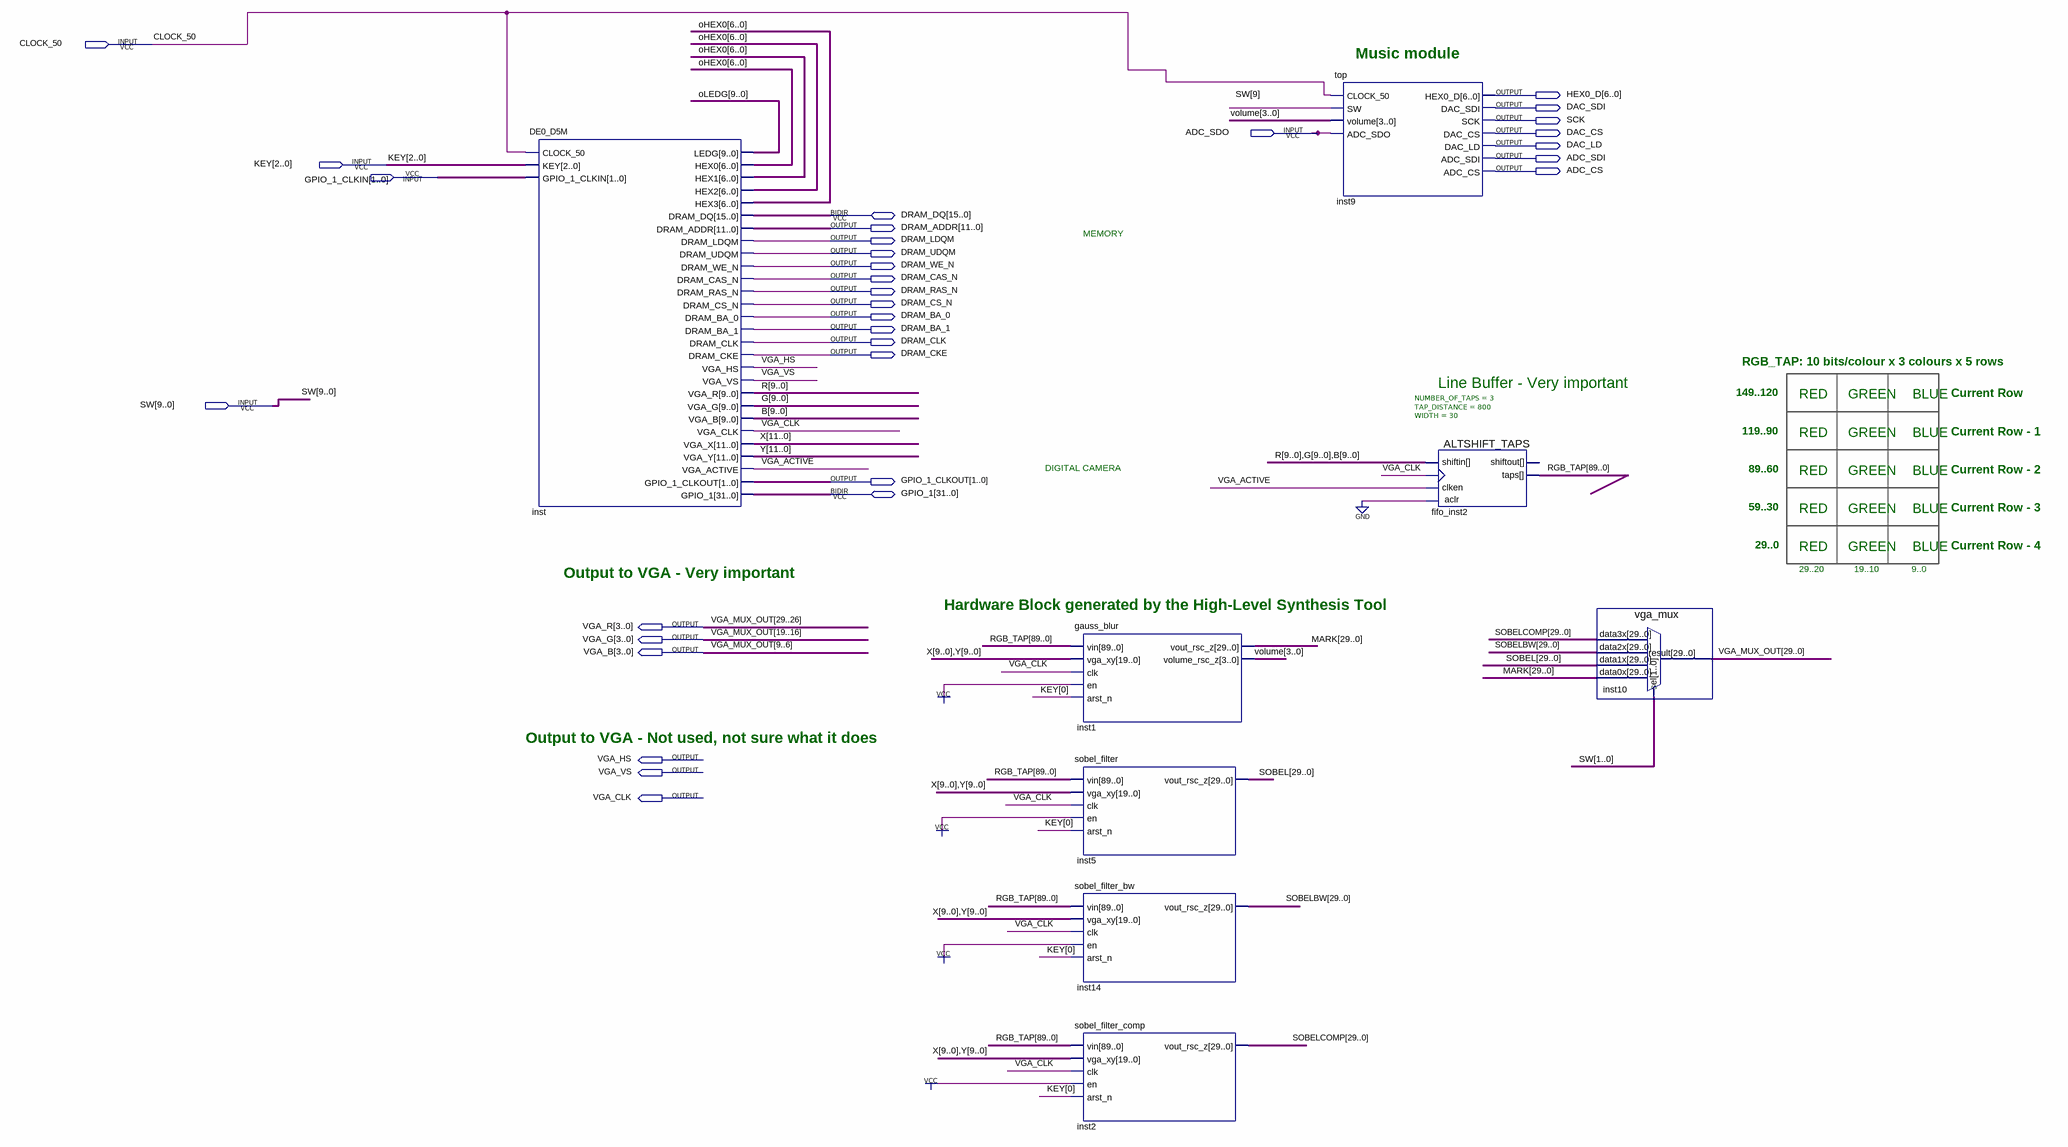
[diagram p0: schematic sheet]
// Quartus schematic TOP_DE0_CAMERA_MOUSE.bdf as structural Verilog: 8 symbols, 32 pins
module TOP_DE0_CAMERA_MOUSE (
  input  CLOCK_50,
  input  ADC_SDO,
  input  [2:0] KEY,
  input  [1:0] GPIO_1_CLKIN,
  input  [9:0] SW,
  inout  [15:0] DRAM_DQ,
  inout  [31:0] GPIO_1,
  output [6:0] HEX0_D,
  output DAC_SDI,
  output SCK,
  output DAC_CS,
  output DAC_LD,
  output ADC_SDI,
  output ADC_CS,
  output [11:0] DRAM_ADDR,
  output DRAM_LDQM,
  output DRAM_UDQM,
  output DRAM_WE_N,
  output DRAM_CAS_N,
  output DRAM_RAS_N,
  output DRAM_CS_N,
  output DRAM_BA_0,
  output DRAM_BA_1,
  output DRAM_CLK,
  output DRAM_CKE,
  output [1:0] GPIO_1_CLKOUT,
  output [3:0] VGA_R,
  output [3:0] VGA_G,
  output [3:0] VGA_B,
  output VGA_HS,
  output VGA_VS,
  output VGA_CLK
);

  wire VGA_ACTIVE;
  wire [3:0] volume;
  wire [6:0] oHEX0;
  wire [9:0] B, G, oLEDG, R;
  wire [11:0] X, Y;
  wire [25:0] VGA_MUX_OUT;
  wire [29:0] MARK, SOBEL, SOBELBW, SOBELCOMP;
  wire [89:0] RGB_TAP;

  DE0_D5M inst (
    .CLOCK_50(CLOCK_50), .KEY(KEY), .GPIO_1_CLKIN(GPIO_1_CLKIN), .LEDG(oLEDG), .HEX0(oHEX0), .HEX1(oHEX0),
    .HEX2(oHEX0), .HEX3(oHEX0), .DRAM_ADDR(DRAM_ADDR), .DRAM_LDQM(DRAM_LDQM), .DRAM_UDQM(DRAM_UDQM),
    .DRAM_WE_N(DRAM_WE_N), .DRAM_CAS_N(DRAM_CAS_N), .DRAM_RAS_N(DRAM_RAS_N), .DRAM_CS_N(DRAM_CS_N),
    .DRAM_BA_0(DRAM_BA_0), .DRAM_BA_1(DRAM_BA_1), .DRAM_CLK(DRAM_CLK), .DRAM_CKE(DRAM_CKE), .VGA_HS(VGA_HS),
    .VGA_VS(VGA_VS), .VGA_R(R), .VGA_G(G), .VGA_B(B), .VGA_CLK(VGA_CLK), .VGA_X(X), .VGA_Y(Y),
    .VGA_ACTIVE(VGA_ACTIVE), .GPIO_1_CLKOUT(GPIO_1_CLKOUT), .DRAM_DQ(DRAM_DQ), .GPIO_1(GPIO_1));
  gauss_blur inst1 (
    .vin(RGB_TAP), .vga_xy({X[9:0], Y[9:0]}), .clk(VGA_CLK), .en(1'b1), .arst_n(KEY[0]), .vout_rsc_z(MARK),
    .volume_rsc_z(volume));
  sobel_filter inst5 (
    .vin(RGB_TAP), .vga_xy({X[9:0], Y[9:0]}), .clk(VGA_CLK), .en(1'b1), .arst_n(KEY[0]), .vout_rsc_z(SOBEL));
  sobel_filter_bw inst14 (
    .vin(RGB_TAP), .vga_xy({X[9:0], Y[9:0]}), .clk(VGA_CLK), .en(1'b1), .arst_n(KEY[0]), .vout_rsc_z(SOBELBW));
  sobel_filter_comp inst2 (
    .vin(RGB_TAP), .vga_xy({X[9:0], Y[9:0]}), .clk(VGA_CLK), .en(1'b1), .arst_n(KEY[0]),
    .vout_rsc_z(SOBELCOMP));
  top inst9 (
    .CLOCK_50(CLOCK_50), .SW(SW[9]), .volume(volume), .ADC_SDO(ADC_SDO), .HEX0_D(HEX0_D), .DAC_SDI(DAC_SDI),
    .SCK(SCK), .DAC_CS(DAC_CS), .DAC_LD(DAC_LD), .ADC_SDI(ADC_SDI), .ADC_CS(ADC_CS));
  ALTSHIFT_TAPS #(.NUMBER_OF_TAPS(3), .TAP_DISTANCE(800), .WIDTH(30)) fifo_inst2 (
    .shiftin({R, G, B}), .clken(VGA_ACTIVE), .clock(VGA_CLK), .aclr(1'b0), .taps(RGB_TAP));  // open: shiftout
  vga_mux inst10 (
    .data3x(SOBELCOMP), .data2x(SOBELBW), .data1x(SOBEL), .data0x(MARK), .sel(SW[1:0]),
    .result({VGA_R, VGA_MUX_OUT[25:20], VGA_G, VGA_MUX_OUT[15:10], VGA_B, VGA_MUX_OUT[5:0]}));

  // Other names for the same wires on the sheet: VGA_MUX_OUT (some bits) = {VGA_R, VGA_G, VGA_B}

  // Notes on the sheet:
  //   Music module
  //   MEMORY
  //   RGB_TAP: 10 bits/colour x 3 colours x 5 rows
  //   Line Buffer - Very important
  //   149..120
  //   RED     GREEN    BLUE
  //   Current Row
  //   119..90
  //   RED     GREEN    BLUE
  //   Current Row - 1
  //   DIGITAL CAMERA
  //   89..60
  //   RED     GREEN    BLUE
  //   Current Row - 2
  //   59..30
  //   RED     GREEN    BLUE
  //   Current Row - 3
  //   29..0
  //   RED     GREEN    BLUE
  //   Current Row - 4
  //   Output to VGA - Very important
  //   29..20            19..10             9..0
  //   Hardware Block generated by the High-Level Synthesis Tool
  //   Output to VGA - Not used, not sure what it does
endmodule
